# EAGLE design main (EAGLE 7.2.0)
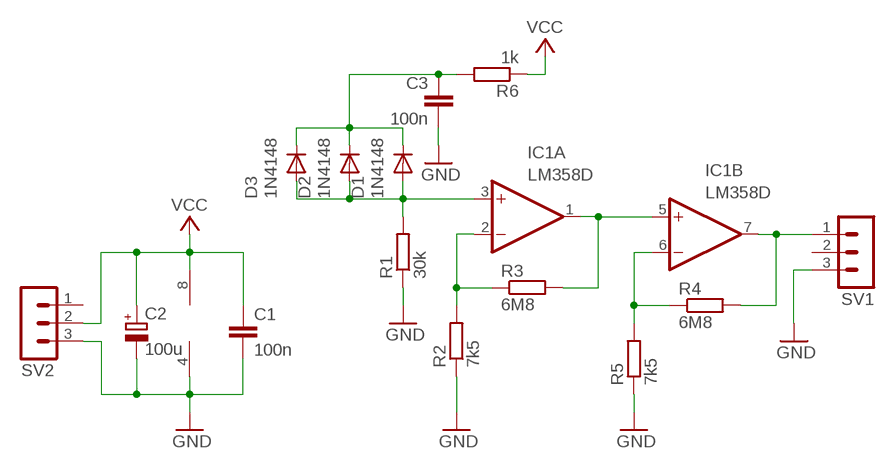
[diagram p0: schematic, sheet 1]

## Parts
C1  100n  C-EUC1608  [C1608]
C2  100u  CPOL-EUE2.5-5  [E2,5-5]
C3  100n  C-EUC1608  [C1608]
D1  1N4148  1N4148DO35-7  [DO35-7]
D2  1N4148  1N4148DO35-7  [DO35-7]
D3  1N4148  1N4148DO35-7  [DO35-7]
IC1  LM358D  [SO08]
R1  30k  R-EU_0204/2V  [0204V]
R2  7k5  R-EU_0204/2V  [0204V]
R3  6M8  R-EU_0204/2V  [0204V]
R4  6M8  R-EU_0204/2V  [0204V]
R5  7k5  R-EU_0204/2V  [0204V]
R6  1k  R-EU_0204/2V  [0204V]
SV1  MA03-1  [MA03-1]
SV2  MA03-1  [MA03-1]

## Nets
GND: C1.2 C2.- C3.2 IC1.4(P:V-) R1.1 R2.1 R5.1 SV1.3 SV2.3
N$1: IC1.6(B:-IN) R4.1 R5.2
N$2: IC1.2(A:-IN) R2.2 R3.1
N$3: IC1.1(A:OUT) IC1.5(B:+IN) R3.2
N$4: D1.A D2.A D3.A IC1.3(A:+IN) R1.2
N$5: IC1.7(B:OUT) R4.2 SV1.1
N$6: C3.1 D1.C D2.C D3.C R6.2
VCC: C1.1 C2.+ IC1.8(P:V+) R6.1 SV2.2
Unconnected: SV1.2 SV2.1

## Library data of the parts
C1 C3 = resistor:C-EU: CAPACITOR, European symbol
C2 = resistor:CPOL-EU: POLARIZED CAPACITOR, European symbol
D1-D3 = diode:1N4148: DIODE high speed (Philips)
IC1 = linear:LM358: OP AMP also LM158; LM258; LM2904 Source: http://cache.national.com/ds/LM/LM158.pdf
R1-R6 = resistor:R-EU_: RESISTOR, European symbol
SV1 SV2 = con-lstb:MA03-1: PIN HEADER; OC_FARNELL: unknown; OC_NEWARK: unknown

## Board
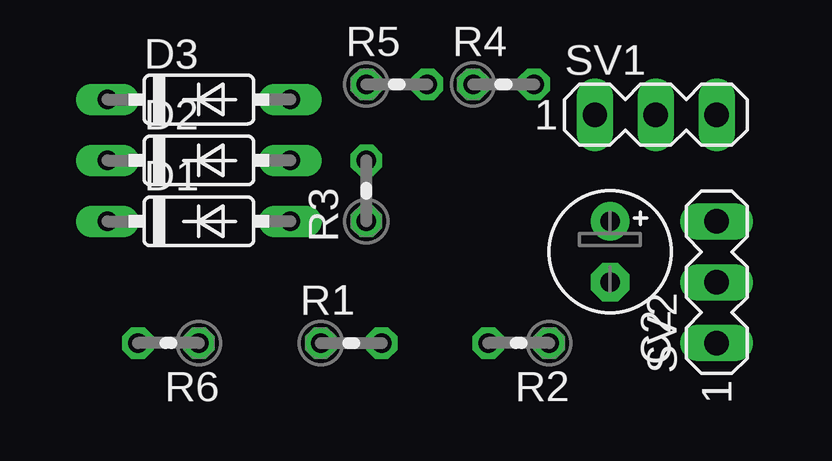
[diagram p1: board, top side]
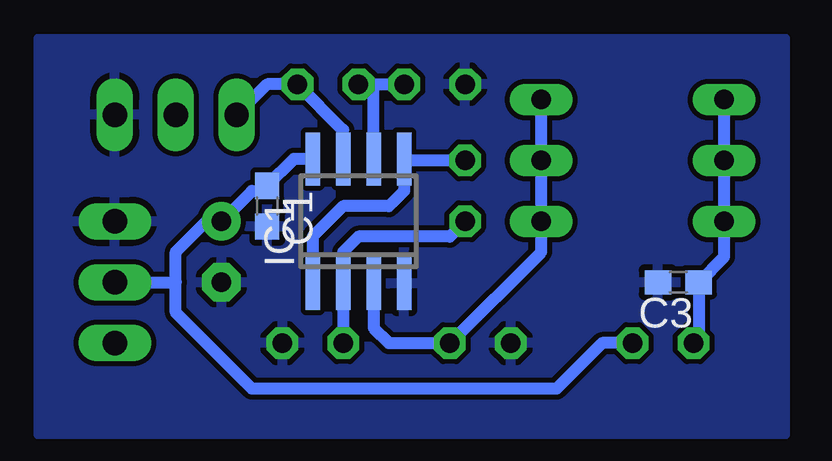
[diagram p2: board, bottom side, seen from below]

No outline drawn. Coordinates in mm, seen from the top.
Copper layers (1*16): Top 0.035mm / dielectric 1.5mm / Bottom 0.035mm
Design rules "default": minimum track width 10mil, minimum drill 24mil, track to track 8mil, track to pad 8mil, pad to pad 8mil, via to via 8mil, smd to smd 8mil, copper to edge 40mil, drill to drill 8mil, minimum pad ring 10mil, minimum via ring 8mil, stop-mask expansion 4mil, vias tented up to drill 0mil, thermal gap 10mil

### Footprints (pad centres in the part's own frame; a part is rotated, then mirrored left to right if it is on the bottom)
C1608 = smd 1.1 x 1: 1 -0.85,0; 2 0.85,0
E2,5-5 = drill 0.813 pad 1.6: + -1.27,0 | drill 0.813 pad 1.6 octagon: - 1.27,0
DO35-7 = drill 0.813 long: A 3.81,0; C -3.81,0
SO08 = smd 0.6 x 2.2: 1 -1.905,-2.6; 2 -0.635,-2.6; 3 0.635,-2.6; 4 1.905,-2.6; 5 1.905,2.6; 6 0.635,2.6; 7 -0.635,2.6; 8 -1.905,2.6
0204V = drill 0.813 octagon: 1 -1.27,0; 2 1.27,0
MA03-1 = drill 1.016 long: 1 -2.54,0; 2 0,0; 3 2.54,0

### Placement (x,y rotation side)
C1  21.59,9.53 270 bottom
C2  23.5,7.62 270 top
C3  4.45,6.35 180 bottom
D1  6.35,8.89 0 top
D2  6.35,11.43 0 top
D3  6.35,13.97 0 top
IC1  17.78,8.89 0 bottom
R1  12.7,3.81 0 top
R2  19.68,3.81 180 top
R3  13.34,10.16 90 top
R4  19.05,14.61 0 top
R5  14.61,14.61 0 top
R6  5.08,3.81 180 top
SV1  25.4,13.34 0 top
SV2  27.94,6.35 90 top

### Tracks (layer width: path | path; a pad name or v marks a point on that pad's centre or on a via)
GND
  pour Bottom: 0,0 31.11,0 31.11,16.51 0,16.51
N$1
  Bottom 0.508: IC1.6 17.14,14.61 R4.1 R5.2
N$2
  Bottom 0.508: R2.2 IC1.2 18.41,7.62 17.78,8.26 13.97,8.26 R3.1
N$3
  Bottom 0.508: R3.2 15.81,11.43 IC1.5 15.88,10.16 16.51,9.53 18.41,9.53 19.68,8.26 IC1.1
N$4
  Bottom 0.508: D3.A D2.A D1.A 10.16,7.62 R1.2 16.51,3.81 17.14,4.45 IC1.3
N$5
  Bottom 0.508: IC1.7 18.41,12.7 R4.2 21.59,14.61 SV1.1
N$6
  Bottom 0.508: D3.C D2.C D1.C 2.54,7.41 C3.1 3.6,4.03 R6.2
VCC
  Bottom 0.508: IC1.8 20.48,11.49 C1.1 21.8,10.16 22.23,10.16 C2.+ 24.13,8.89 25.4,7.62 25.4,6.35 | R6.1 7.62,3.81 9.53,1.91 22.23,1.91 25.4,5.08 25.4,6.35 | SV2.2 25.4,6.35